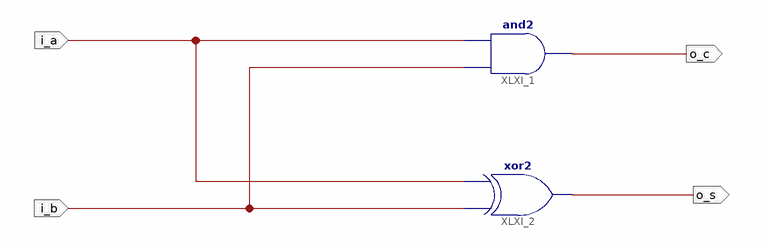
[diagram p0: schematic sheet 1]
// Xilinx ISE schematic Laby5.sch (spartan3e) as structural Verilog: 2 symbols, 4 ports
module Laby5 (
  input  i_b,
  input  i_a,
  output o_c,
  output o_s
);

  and XLXI_1 (o_c, i_b, i_a);
  xor XLXI_2 (o_s, i_b, i_a);
endmodule
